# EAGLE design M506C (EAGLE 6.6.0)
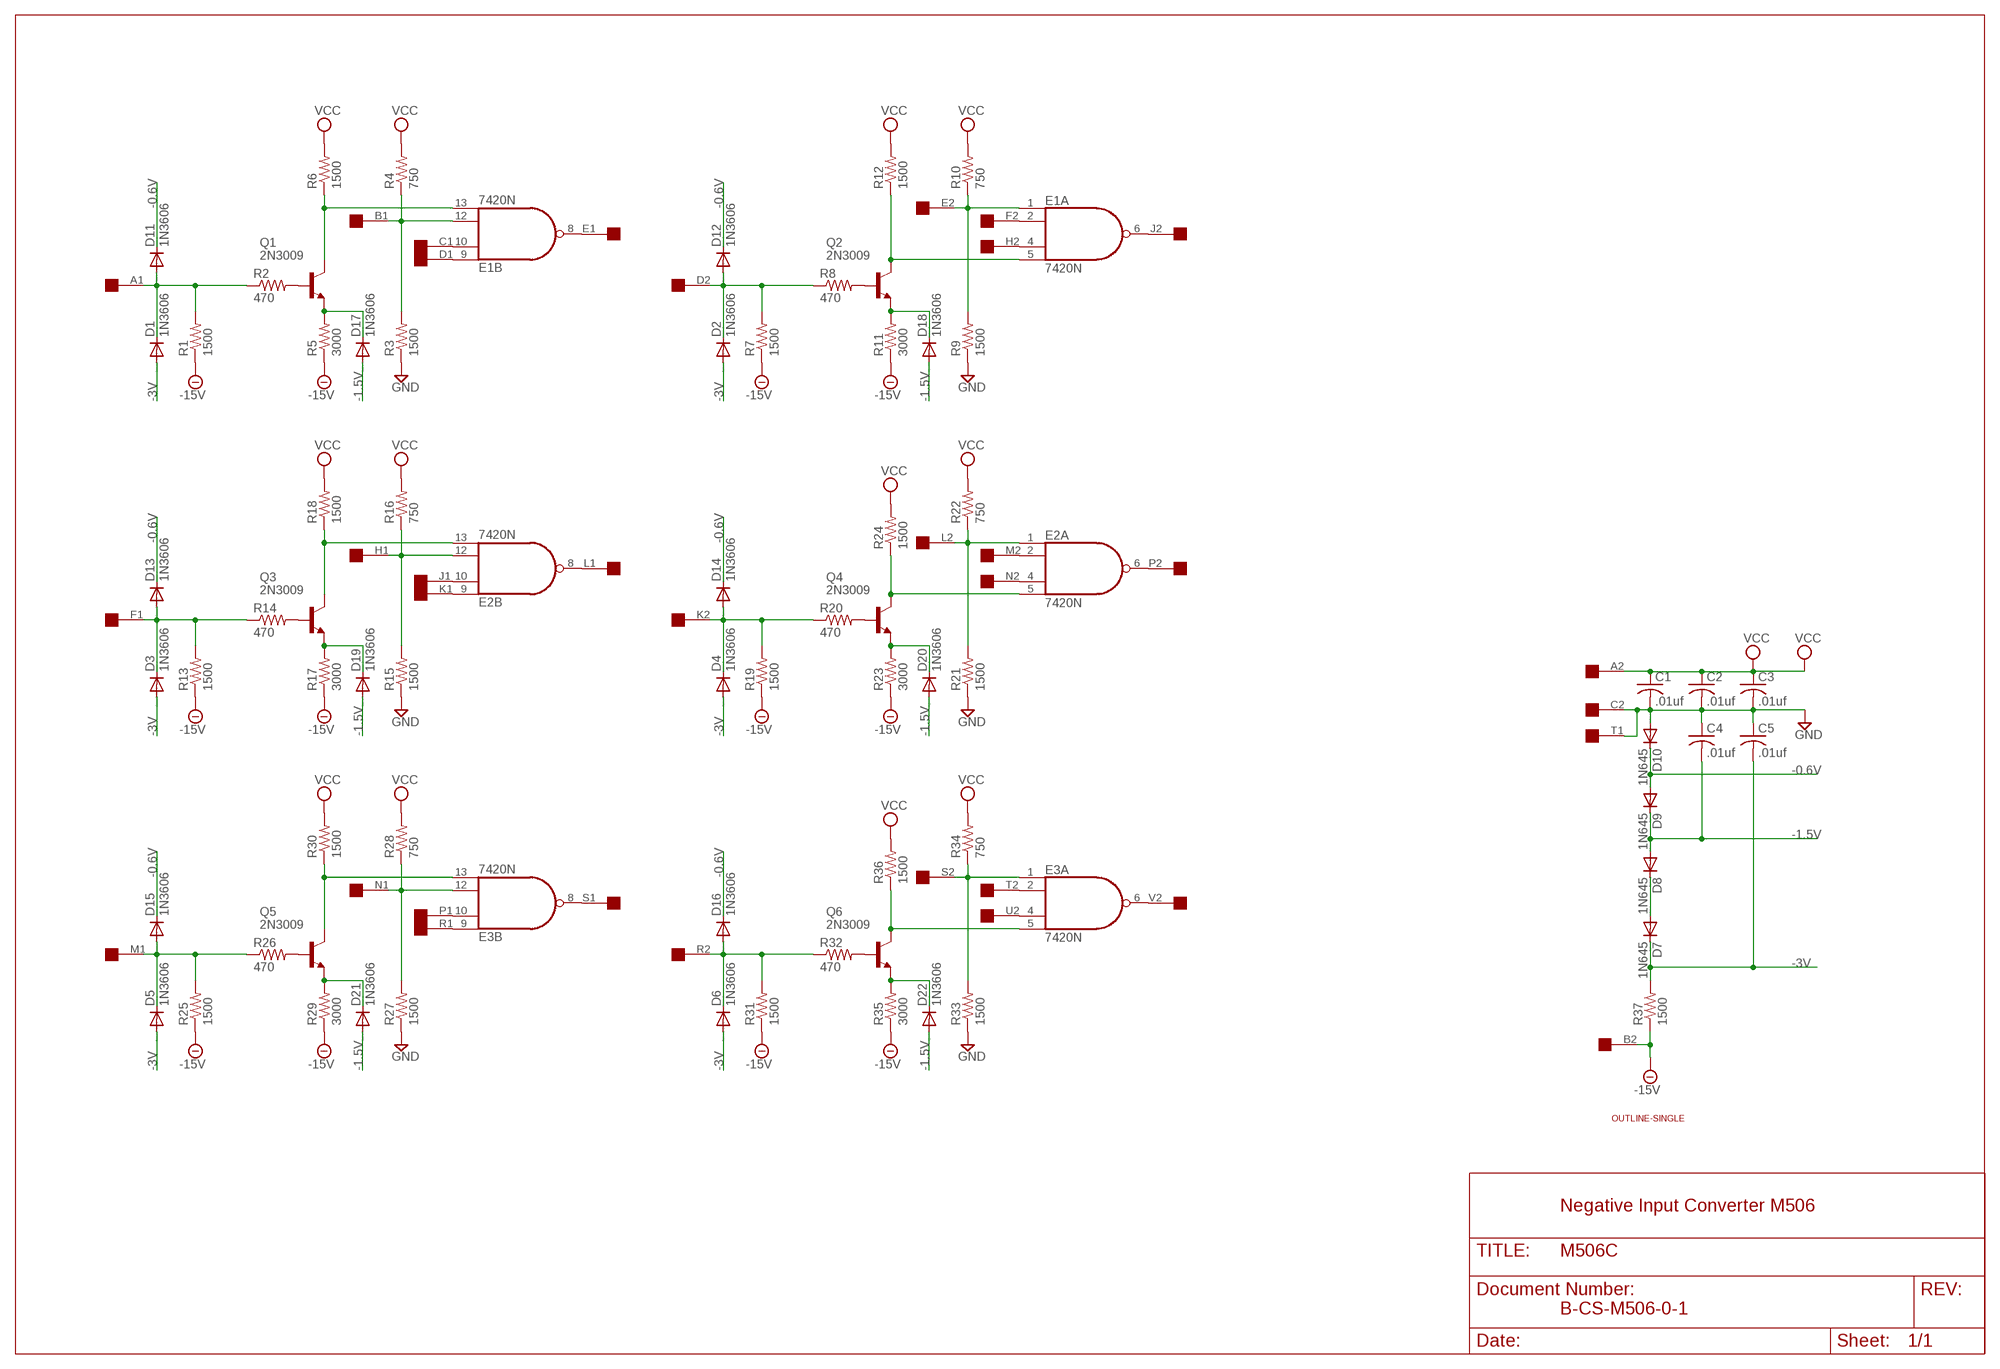
[diagram p0: schematic, sheet 1]

## Parts
C1  .01uf  C-US050-025X075  [C050-025X075]
C2  .01uf  C-US050-025X075  [C050-025X075]
C3  .01uf  C-US050-025X075  [C050-025X075]
C4  .01uf  C-US050-025X075  [C050-025X075]
C5  .01uf  C-US050-025X075  [C050-025X075]
D1  1N3606  1N4148DO35-10  [DO35-10]
D2  1N3606  1N4148DO35-10  [DO35-10]
D3  1N3606  1N4148DO35-10  [DO35-10]
D4  1N3606  1N4148DO35-10  [DO35-10]
D5  1N3606  1N4148DO35-10  [DO35-10]
D6  1N3606  1N4148DO35-10  [DO35-10]
D7  1N645  1N4148DO35-10  [DO35-10]
D8  1N645  1N4148DO35-10  [DO35-10]
D9  1N645  1N4148DO35-10  [DO35-10]
D10  1N645  1N4148DO35-10  [DO35-10]
D11  1N3606  1N4148DO35-10  [DO35-10]
D12  1N3606  1N4148DO35-10  [DO35-10]
D13  1N3606  1N4148DO35-10  [DO35-10]
D14  1N3606  1N4148DO35-10  [DO35-10]
D15  1N3606  1N4148DO35-10  [DO35-10]
D16  1N3606  1N4148DO35-10  [DO35-10]
D17  1N3606  1N4148DO35-10  [DO35-10]
D18  1N3606  1N4148DO35-10  [DO35-10]
D19  1N3606  1N4148DO35-10  [DO35-10]
D20  1N3606  1N4148DO35-10  [DO35-10]
D21  1N3606  1N4148DO35-10  [DO35-10]
D22  1N3606  1N4148DO35-10  [DO35-10]
E1  7420N  74S20N  [DIL14]
E2  7420N  74S20N  [DIL14]
E3  7420N  74S20N  [DIL14]
Q1  2N3009  2N3019  [TO39]
Q2  2N3009  2N3019  [TO39]
Q3  2N3009  2N3019  [TO39]
Q4  2N3009  2N3019  [TO39]
Q5  2N3009  2N3019  [TO39]
Q6  2N3009  2N3019  [TO39]
R1  1500  R-US_0207/10  [0207/10]
R2  470  R-US_0207/10  [0207/10]
R3  1500  R-US_0207/10  [0207/10]
R4  750  R-US_0207/10  [0207/10]
R5  3000  R-US_0207/10  [0207/10]
R6  1500  R-US_0207/10  [0207/10]
R7  1500  R-US_0207/10  [0207/10]
R8  470  R-US_0207/10  [0207/10]
R9  1500  R-US_0207/10  [0207/10]
R10  750  R-US_0207/10  [0207/10]
R11  3000  R-US_0207/10  [0207/10]
R12  1500  R-US_0207/10  [0207/10]
R13  1500  R-US_0207/10  [0207/10]
R14  470  R-US_0207/10  [0207/10]
R15  1500  R-US_0207/10  [0207/10]
R16  750  R-US_0207/10  [0207/10]
R17  3000  R-US_0207/10  [0207/10]
R18  1500  R-US_0207/10  [0207/10]
R19  1500  R-US_0207/10  [0207/10]
R20  470  R-US_0207/10  [0207/10]
R21  1500  R-US_0207/10  [0207/10]
R22  750  R-US_0207/10  [0207/10]
R23  3000  R-US_0207/10  [0207/10]
R24  1500  R-US_0207/10  [0207/10]
R25  1500  R-US_0207/10  [0207/10]
R26  470  R-US_0207/10  [0207/10]
R27  1500  R-US_0207/10  [0207/10]
R28  750  R-US_0207/10  [0207/10]
R29  3000  R-US_0207/10  [0207/10]
R30  1500  R-US_0207/10  [0207/10]
R31  1500  R-US_0207/10  [0207/10]
R32  470  R-US_0207/10  [0207/10]
R33  1500  R-US_0207/10  [0207/10]
R34  750  R-US_0207/10  [0207/10]
R35  3000  R-US_0207/10  [0207/10]
R36  1500  R-US_0207/10  [0207/10]
R37  1500  R-US_0207/10  [0207/10]
U$2  SINGLE  [EDGE-CON2]
U$4  OUTLINE-SINGLE  [SINGLE]

## Nets
-0.6V [Supply]: D9.A D10.C D11.C D12.C D13.C D14.C D15.C D16.C
-1.5V [Supply]: C4.2 D8.A D9.C D17.A D18.A D19.A D20.A D21.A D22.A
-3V: C5.2 D1.A D2.A D3.A D4.A D5.A D6.A D7.C R37.2
-15V [Supply]: R1.1 R5.1 R7.1 R11.1 R13.1 R17.1 R19.1 R23.1 R25.1 R29.1 R31.1 R35.1 R37.1 U$2.B2
GND [Supply]: C1.2 C2.2 C3.2 C4.1 C5.1 D10.A R3.1 R9.1 R15.1 R21.1 R27.1 R33.1 U$2.C2 U$2.T1
N$1: D1.C D11.A R1.2 R2.1 U$2.A1
N$2: Q1.2(B) R2.2
N$3: D17.C Q1.1(E) R5.2
N$4: E1.12(B:I2) R3.2 R4.1 U$2.B1
N$5: E1.13(B:I3) Q1.3(C) R6.1
N$6: E1.10(B:I1) U$2.C1
N$7: E1.9(B:I0) U$2.D1
N$8: E1.8(B:O) U$2.E1
N$9: D2.C D12.A R7.2 R8.1 U$2.D2
N$10: Q2.2(B) R8.2
N$11: D18.C Q2.1(E) R11.2
N$12: E1.1(A:I0) R9.2 R10.1 U$2.E2
N$14: E1.5(A:I3) Q2.3(C) R12.1
N$15: E1.6(A:O) U$2.J2
N$16: E1.2(A:I1) U$2.F2
N$17: E1.4(A:I2) U$2.H2
N$18: D3.C D13.A R13.2 R14.1 U$2.F1
N$19: Q3.2(B) R14.2
N$20: D19.C Q3.1(E) R17.2
N$21: E2.12(B:I2) R15.2 R16.1 U$2.H1
N$22: E2.13(B:I3) Q3.3(C) R18.1
N$23: D5.C D15.A R25.2 R26.1 U$2.M1
N$24: Q5.2(B) R26.2
N$25: D21.C Q5.1(E) R29.2
N$26: D4.C D14.A R19.2 R20.1 U$2.K2
N$27: Q4.2(B) R20.2
N$28: D20.C Q4.1(E) R23.2
N$29: E2.1(A:I0) R21.2 R22.1 U$2.L2
N$30: E2.5(A:I3) Q4.3(C) R24.1
N$31: E3.12(B:I2) R27.2 R28.1 U$2.N1
N$32: E3.13(B:I3) Q5.3(C) R30.1
N$33: D6.C D16.A R31.2 R32.1 U$2.R2
N$34: Q6.2(B) R32.2
N$35: D22.C Q6.1(E) R35.2
N$36: E3.1(A:I0) R33.2 R34.1 U$2.S2
N$37: E3.5(A:I3) Q6.3(C) R36.1
N$38: E2.10(B:I1) U$2.J1
N$39: E2.9(B:I0) U$2.K1
N$40: E3.10(B:I1) U$2.P1
N$41: E3.9(B:I0) U$2.R1
N$42: E2.8(B:O) U$2.L1
N$43: E3.8(B:O) U$2.S1
N$44: E2.2(A:I1) U$2.M2
N$45: E2.4(A:I2) U$2.N2
N$46: E2.6(A:O) U$2.P2
N$47: E3.4(A:I2) U$2.U2
N$48: E3.6(A:O) U$2.V2
N$49: E3.2(A:I1) U$2.T2
N$51: D7.A D8.C
VCC [Supply]: C1.1 C2.1 C3.1 R4.2 R6.2 R10.2 R12.2 R16.2 R18.2 R22.2 R24.2 R28.2 R30.2 R34.2 R36.2 U$2.A2
Unconnected: U$2.U1 U$2.V1

## Notes on the sheet
- Negative Input Converter M506
- B-CS-M506-0-1

## Power pins joined to a net without a drawn wire
GND: E1.7(P:GND) E2.7(P:GND) E3.7(P:GND)
VCC: E1.14(P:VCC) E2.14(P:VCC) E3.14(P:VCC)

## Library data of the parts
C1-C5 = rcl:C-US: CAPACITOR, American symbol
D1-D22 = diode:1N4148: DIODE high speed (Philips)
E1-E3 = 74xx-us:74*20: Dual 4-input NAND gate
Q1-Q6 = transistor-npn:2N3019: NPN Transistor
R1-R37 = rcl:R-US_: RESISTOR, American symbol
U$2 = dec-con:SINGLE: Single-Height DEC board
U$4 = dec-con:OUTLINE-*: Board outlines for DEC boards.

## Net classes
1 Supply: width 0.813 mm

## Board
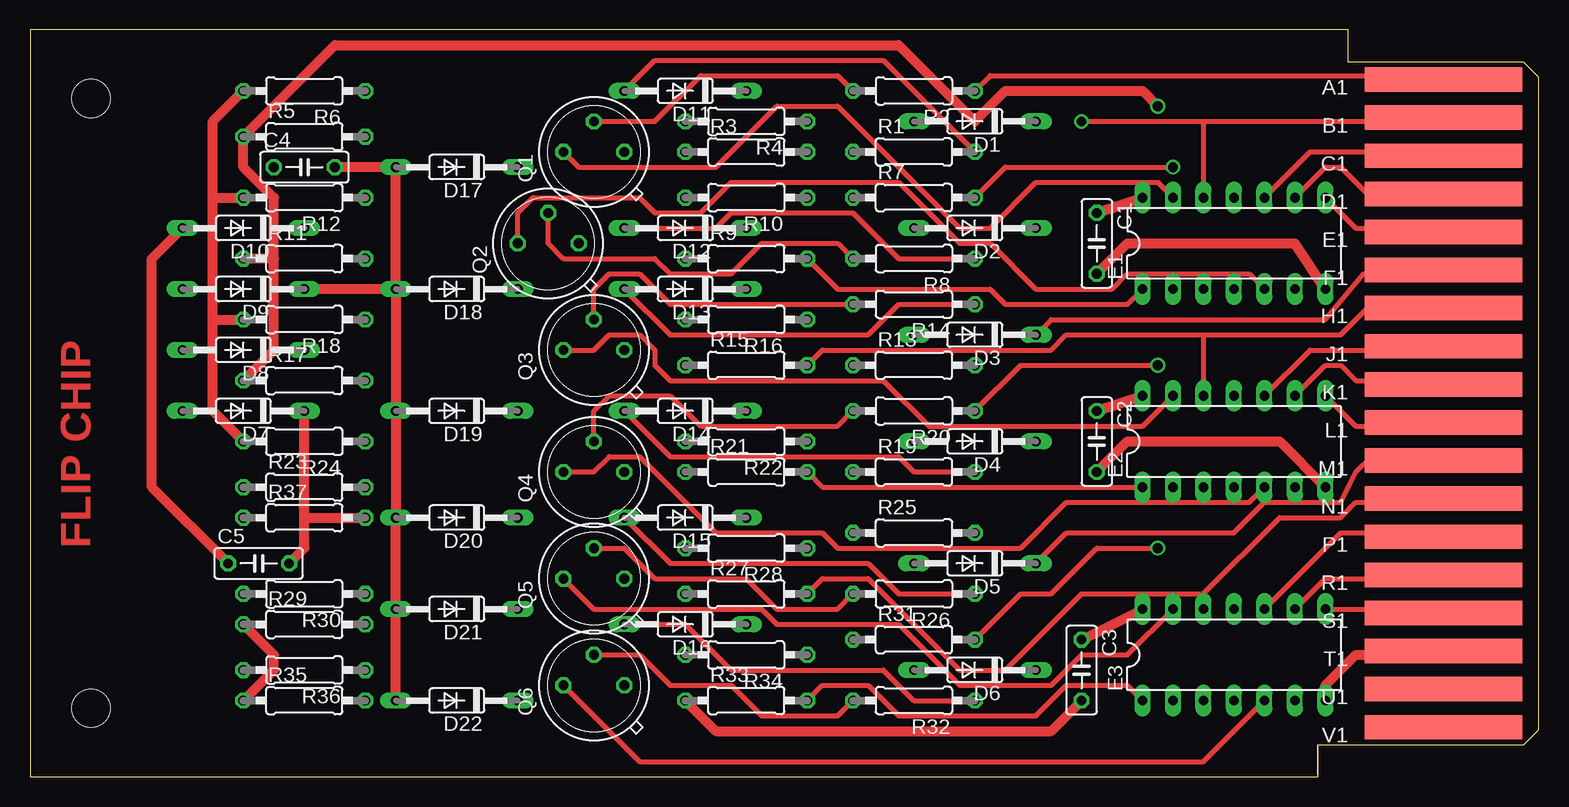
[diagram p1: board, top side]
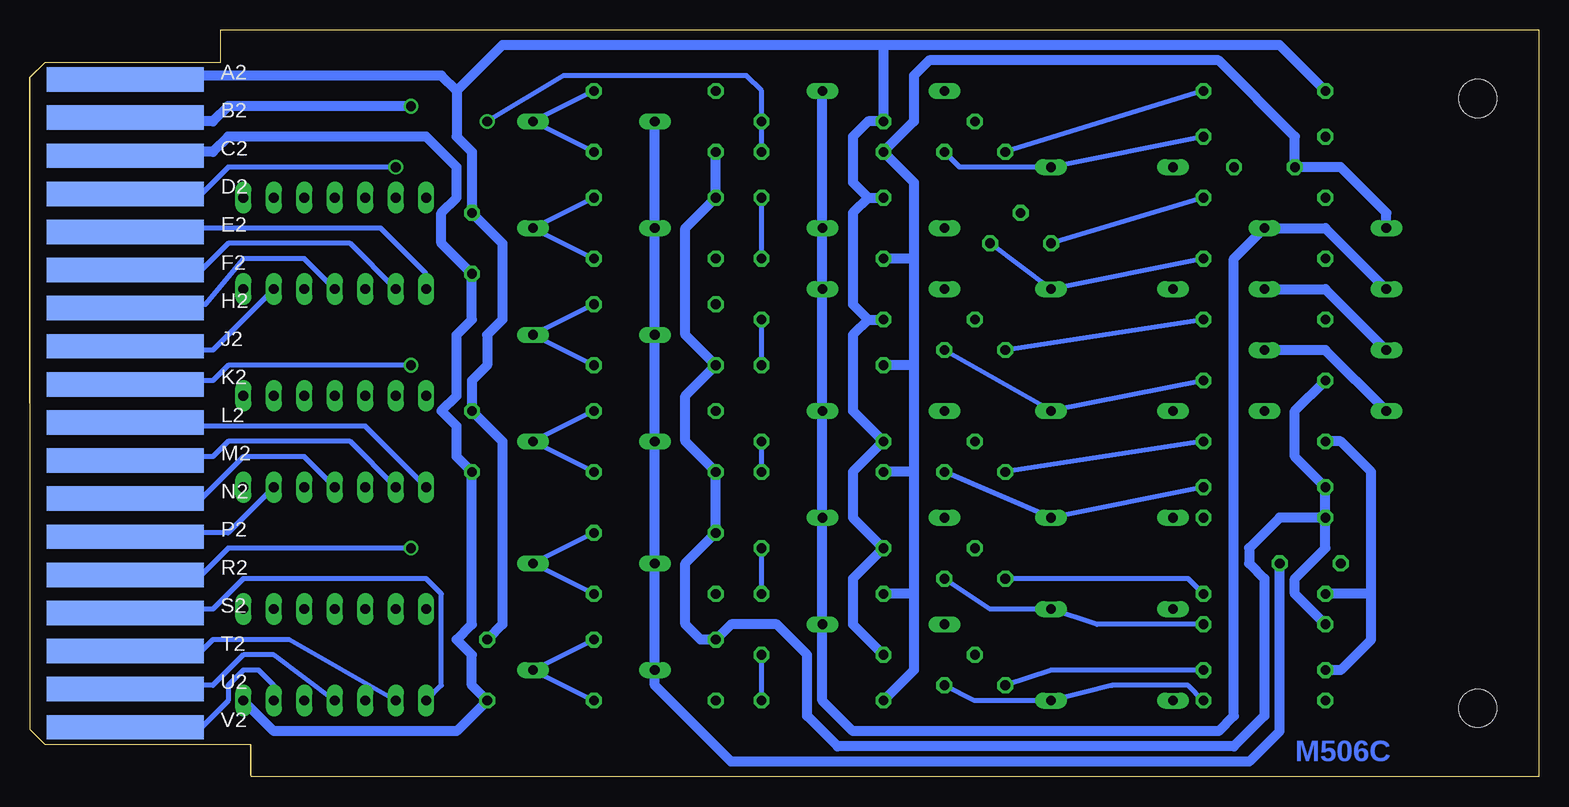
[diagram p2: board, bottom side, seen from below]

Size 125.73 x 62.23 mm. Coordinates in mm from the lower left corner, seen from the top.
Copper layers (1+16): Top 0.035mm / dielectric 1.5mm / Bottom 0.035mm
Design rules "16mils": minimum track width 16mil, minimum drill 32mil, track to track 15mil, track to pad 10mil, pad to pad 10mil, via to via 10mil, smd to smd 10mil, copper to edge 13mil, drill to drill 10mil, minimum pad ring 10mil, minimum via ring 8mil, stop-mask expansion 0mil, vias tented up to drill 0mil, thermal gap 10mil

### Footprints (pad centres in the part's own frame; a part is rotated, then mirrored left to right if it is on the bottom)
C050-025X075 = drill 0.813 octagon: 1 -2.54,0; 2 2.54,0
DO35-10 = drill 0.813 long: A 5.08,0; C -5.08,0
DIL14 = drill 0.813 long: 1 -7.62,-3.81; 2 -5.08,-3.81; 3 -2.54,-3.81; 4 0,-3.81; 5 2.54,-3.81; 6 5.08,-3.81; 7 7.62,-3.81; 8 7.62,3.81; 9 5.08,3.81; 10 2.54,3.81; 11 0,3.81; 12 -2.54,3.81; 13 -5.08,3.81; 14 -7.62,3.81
TO39 = drill 0.813 octagon: 1 0,-2.54; 2 2.54,0; 3 0,2.54
0207/10 = drill 0.813 octagon: 1 -5.08,0; 2 5.08,0
EDGE-CON2 = smd 13.106 x 2.032: A1 7.938,4.128; B1 7.938,7.303; C1 7.938,10.477; D1 7.938,13.652; E1 7.938,16.828; F1 7.938,20.003; H1 7.938,23.177; J1 7.938,26.352; K1 7.938,29.527; L1 7.938,32.703; M1 7.938,35.877; N1 7.938,39.053; P1 7.938,42.227; R1 7.938,45.403; S1 7.938,48.578; T1 7.938,51.752; U1 7.938,54.928; V1 7.938,58.102 | smd 13.106 x 2.032 bottom: A2 7.938,4.128; B2 7.938,7.303; C2 7.938,10.477; D2 7.938,13.652; E2 7.938,16.828; F2 7.938,20.003; H2 7.938,23.177; J2 7.938,26.352; K2 7.938,29.527; L2 7.938,32.703; M2 7.938,35.877; N2 7.938,39.053; P2 7.938,42.227; R2 7.938,45.403; S2 7.938,48.578; T2 7.938,51.752; U2 7.938,54.928; V2 7.938,58.102
SINGLE = hole 3.175: 120.65,56.515; 120.65,5.715

### Placement (x,y rotation side)
C1  88.9,44.45 270 top
C2  88.9,27.94 270 top
C3  87.63,8.89 270 top
C4  22.86,50.8 0 top
C5  19.05,17.78 0 top
D1  78.74,54.61 180 top
D2  78.74,45.72 180 top
D3  78.74,36.83 180 top
D4  78.74,27.94 180 top
D5  78.74,17.78 180 top
D6  78.74,8.89 180 top
D7  17.78,30.48 180 top
D8  17.78,35.56 180 top
D9  17.78,40.64 180 top
D10  17.78,45.72 180 top
D11  54.61,57.15 180 top
D12  54.61,45.72 180 top
D13  54.61,40.64 180 top
D14  54.61,30.48 180 top
D15  54.61,21.59 180 top
D16  54.61,12.7 180 top
D17  35.56,50.8 180 top
D18  35.56,40.64 180 top
D19  35.56,30.48 180 top
D20  35.56,21.59 180 top
D21  35.56,13.97 180 top
D22  35.56,6.35 180 top
E1  100.33,44.45 0 top
E2  100.33,27.94 0 top
E3  100.33,10.16 0 top
Q1  46.99,52.07 90 top
Q2  43.18,44.45 90 top
Q3  46.99,35.56 90 top
Q4  46.99,25.4 90 top
Q5  46.99,16.51 90 top
Q6  46.99,7.62 90 top
R1  73.66,52.07 0 top
R2  73.66,57.15 180 top
R3  59.69,52.07 0 top
R4  59.69,54.61 180 top
R5  22.86,53.34 0 top
R6  22.86,57.15 180 top
R7  73.66,48.26 0 top
R8  73.66,43.18 180 top
R9  59.69,43.18 0 top
R10  59.69,48.26 180 top
R11  22.86,43.18 0 top
R12  22.86,48.26 180 top
R13  73.66,34.29 0 top
R14  73.66,39.37 180 top
R15  59.69,34.29 0 top
R16  59.69,38.1 180 top
R17  22.86,33.02 0 top
R18  22.86,38.1 180 top
R19  73.66,25.4 0 top
R20  73.66,30.48 180 top
R21  59.69,25.4 0 top
R22  59.69,27.94 180 top
R23  22.86,24.13 0 top
R24  22.86,27.94 180 top
R25  73.66,20.32 0 top
R26  73.66,15.24 180 top
R27  59.69,15.24 0 top
R28  59.69,19.05 180 top
R29  22.86,12.7 0 top
R30  22.86,15.24 180 top
R31  73.66,11.43 0 top
R32  73.66,6.35 180 top
R33  59.69,6.35 0 top
R34  59.69,10.16 180 top
R35  22.86,6.35 0 top
R36  22.86,8.89 180 top
R37  22.86,21.59 0 top
U$1  [FLIPCHIP]  0,0 0 top
U$2  125.73,62.23 180 top
U$4  125.73,62.23 180 top

### Tracks (layer width: path | path; a pad name or v marks a point on that pad's centre or on a via)
-0.6V
  Bottom 0.813: D9.A 17.78,45.72 D10.C 25.4,43.18 25.4,5.08 26.67,3.81 57.15,3.81 59.69,6.35 D16.C D15.C D14.C D13.C D12.C D11.C
-1.5V
  Top 0.813: C4.2 D17.A D18.A | D18.A D9.C | D22.A D21.A D20.A D19.A D18.A
  Bottom 0.813: D8.A 17.78,40.64 D9.C
-3V
  Top 0.813: C5.2 22.86,19.05 22.86,21.59 | 22.86,21.59 D7.C | 22.86,21.59 R37.2
  Bottom 0.813: D1.A D2.A D3.A D4.A D5.A D6.A 73.66,7.62 67.31,1.27 24.13,1.27 21.59,3.81 C5.2
-15V  (via drill 0.81)
  Top 0.813: R35.1 20.32,8.89 20.32,10.16 R29.1 | R17.1 20.32,35.56 20.32,43.18 | 20.32,43.18 R11.1 | 20.32,43.18 20.32,48.26 17.78,50.8 R5.1 25.4,60.96 72.39,60.96 78.74,54.61 81.28,57.15 92.71,57.15 v93.98,55.88
  Bottom 0.813: R29.1 20.32,15.24 20.32,16.51 17.78,19.05 R37.1 | R37.1 R23.1 20.32,26.67 20.32,30.48 R17.1 | R1.1 R7.1 71.12,45.72 71.12,36.83 R13.1 71.12,31.75 71.12,27.94 R19.1 R25.1 71.12,17.78 71.12,12.7 69.85,11.43 R31.1 67.31,12.7 63.5,12.7 60.96,10.16 60.96,5.08 58.42,2.54 25.4,2.54 22.86,5.08 22.86,16.51 24.13,17.78 24.13,19.05 21.59,21.59 R37.1 | U$2.B2 117.8,54.61 110.49,54.61 109.22,55.88 v93.98,55.88
GND
  Top 0.813: C5.1 10.16,24.13 10.16,43.18 D10.A | U$2.T1 117.76,10.16 111.76,10.16 110.49,10.16 107.95,7.62 E3.7 | C3.2 85.09,3.81 57.15,3.81 R33.1 | E1.7 105.41,44.45 91.44,44.45 C1.2 | E2.7 104.14,27.94 91.44,27.94 C2.2
  Bottom 0.813: R33.1 52.07,8.89 52.07,15.24 | 52.07,15.24 R27.1 | 52.07,25.4 R21.1 | 52.07,25.4 52.07,15.24 | 52.07,34.29 R15.1 | 52.07,34.29 52.07,25.4 | 52.07,43.18 52.07,34.29 | 52.07,43.18 52.07,49.53 R3.1 52.07,54.61 52.07,58.42 50.8,59.69 26.67,59.69 20.32,53.34 C4.1 16.51,50.8 12.7,46.99 D10.A | 52.07,43.18 R9.1 | U$2.C2 117.78,52.07 110.49,52.07 109.22,53.34 92.71,53.34 90.17,50.8 90.17,48.26 91.44,46.99 91.44,44.45 C1.2 88.9,38.1 90.17,36.83 90.17,31.75 91.44,30.48 90.17,29.21 90.17,26.67 C2.2 88.9,12.7 90.17,11.43 88.9,10.16 88.9,7.62 C3.2 90.17,3.81 105.41,3.81 E3.7
N$1
  Top 0.406: U$2.A1 117.24,58.02 116.84,58.42 80.01,58.42 R2.1 | D11.A 52.07,59.69 71.12,59.69 R1.2
  Bottom 0.406: R1.2 D1.C R2.1
N$2
  Top 0.406: Q1.2 52.07,54.61 55.88,58.42 67.31,58.42 R2.2
N$3
  Bottom 0.406: R5.2 D17.C 48.26,50.8 Q1.1
N$4  (via drill 0.81)
  Top 0.406: U$2.B1 117.8,54.61 97.79,54.61 | v87.63,54.61 97.79,54.61 | 97.79,54.61 E1.12
  Bottom 0.406: R3.2 R4.1 64.77,57.15 66.04,58.42 81.28,58.42 v87.63,54.61
N$5
  Top 0.406: E1.13 93.98,49.53 83.82,49.53 80.01,45.72 77.47,45.72 67.31,55.88 62.23,55.88 57.15,50.8 45.72,50.8 Q1.3
  Bottom 0.406: R6.1 Q1.3
N$6
  Top 0.406: U$2.C1 117.17,51.74 116.84,52.07 106.68,52.07 E1.10
N$7
  Top 0.406: U$2.D1 115.88,48.56 115.57,48.26 111.76,48.26 109.22,50.8 107.95,50.8 E1.9
N$8
  Top 0.406: U$2.E1 117.17,45.39 116.84,45.72 110.49,45.72 E1.8
N$9  (via drill 0.81)
  Top 0.406: v95.25,50.8 81.28,50.8 R7.2 | D12.A 57.15,45.72 58.42,46.99 68.58,46.99 72.39,43.18 R8.1
  Bottom 0.406: R8.1 D2.C R7.2 | U$2.D2 117.78,48.26 111.76,48.26 109.22,50.8 v95.25,50.8
N$10
  Top 0.406: Q2.2 43.18,44.45 44.45,43.18 52.07,43.18 53.34,41.91 58.42,41.91 60.96,44.45 67.31,44.45 R8.2
N$11
  Bottom 0.406: R11.2 D18.C Q2.1
N$12
  Top 0.406: E1.1 91.44,39.37 81.28,39.37 80.01,40.64 67.31,40.64 R9.2
  Bottom 0.406: R9.2 R10.1 | U$2.E2 117.17,45.39 116.84,45.72 96.52,45.72 92.71,41.91 E1.1
N$14
  Top 0.406: E1.5 101.6,41.91 91.44,41.91 90.17,40.64 83.82,40.64 80.01,44.45 77.47,44.45 72.39,49.53 58.42,49.53 55.88,46.99 52.07,46.99 50.8,48.26 41.91,48.26 40.64,46.99 Q2.3
  Bottom 0.406: R12.1 Q2.3
N$15
  Bottom 0.406: U$2.J2 117.17,35.89 116.84,35.56 110.49,35.56 E1.6
N$16
  Bottom 0.406: U$2.F2 117.12,42.19 116.84,41.91 111.76,41.91 109.22,44.45 99.06,44.45 E1.2
N$17
  Bottom 0.406: U$2.H2 117.17,39.04 116.84,39.37 111.12,39.37 107.95,43.18 102.87,43.18 E1.4
N$18
  Top 0.406: D3.C 85.09,38.1 107.95,38.1 111.12,41.91 117.81,41.91 U$2.F1 | D13.A 53.34,36.83 69.85,36.83 72.39,39.37 R14.1
  Bottom 0.406: R13.2 D3.C R14.1
N$19
  Top 0.406: Q3.2 46.99,40.64 48.26,41.91 50.8,41.91 53.34,39.37 R14.2
N$20
  Bottom 0.406: R17.2 D19.C Q3.1
N$21
  Top 0.406: U$2.H1 117.76,39.37 111.76,39.37 109.22,36.83 97.79,36.83 | 97.79,36.83 E2.12 | 97.79,36.83 86.36,36.83 85.09,35.56 66.04,35.56 R15.2
  Bottom 0.406: R15.2 R16.1
N$22
  Top 0.406: E2.13 92.71,29.21 74.93,29.21 71.12,33.02 53.34,33.02 52.07,34.29 52.07,35.56 50.8,36.83 48.26,36.83 46.99,35.56 Q3.3
  Bottom 0.406: R18.1 Q3.3
N$23
  Top 0.406: U$2.M1 117.17,26.34 116.84,26.67 111.76,26.67 110.49,25.4 109.22,22.86 102.87,22.86 100.33,20.32 86.36,20.32 D5.C | D15.A 53.34,17.78 69.85,17.78 72.39,15.24 R26.1
  Bottom 0.406: R26.1 D5.C R25.2
N$24
  Top 0.406: Q5.2 49.53,19.05 52.07,16.51 59.69,16.51 62.23,13.97 67.31,13.97 R26.2
N$25
  Bottom 0.406: R29.2 36.83,12.7 D21.C 45.72,13.97 Q5.1
N$26  (via drill 0.81)
  Top 0.406: v93.98,34.29 82.55,34.29 R20.1 | D14.A 53.34,26.67 72.39,26.67 73.66,25.4 R19.2
  Bottom 0.406: R19.2 D4.C R20.1 | U$2.K2 117.78,33.02 110.49,33.02 109.22,34.29 v93.98,34.29
N$27
  Top 0.406: Q4.2 46.99,30.48 48.26,31.75 53.34,31.75 55.88,29.21 67.31,29.21 R20.2
N$28
  Bottom 0.406: Q4.1 D20.C R23.2
N$29
  Top 0.406: E2.1 66.04,24.13 R21.2
  Bottom 0.406: R21.2 R22.1 | U$2.L2 117.17,29.54 116.84,29.21 97.79,29.21 E2.1
N$30
  Top 0.406: E2.5 101.6,22.86 86.36,22.86 82.55,19.05 67.31,19.05 66.04,20.32 57.15,20.32 50.8,26.67 48.26,26.67 46.99,25.4 Q4.3
  Bottom 0.406: R24.1 Q4.3
N$31
  Top 0.406: U$2.N1 117.17,23.19 116.84,22.86 110.49,22.86 109.22,21.59 104.14,21.59 97.79,15.24 | 97.79,15.24 E3.12 | 97.79,15.24 87.63,15.24 81.28,8.89 77.47,8.89 69.85,16.51 66.04,16.51 R27.2
  Bottom 0.406: R27.2 R28.1
N$32
  Top 0.406: E3.13 91.44,10.16 87.63,10.16 85.09,7.62 77.47,7.62 72.39,12.7 62.23,12.7 60.96,13.97 46.99,13.97 Q5.3
  Bottom 0.406: R30.1 29.21,16.51 Q5.3
N$33  (via drill 0.81)
  Top 0.406: v93.98,19.05 88.9,19.05 85.09,15.24 82.55,15.24 R31.2 | D16.A 54.61,12.7 58.42,8.89 71.12,8.89 73.66,6.35 R32.1
  Bottom 0.406: R32.1 D6.C R31.2 | U$2.R2 117.17,16.84 116.84,16.51 111.76,16.51 109.22,19.05 v93.98,19.05
N$34
  Top 0.406: R32.2 67.31,5.08 60.96,5.08 58.42,7.62 53.34,7.62 50.8,10.16 Q6.2
N$35
  Bottom 0.406: R35.2 29.21,7.62 35.56,7.62 D22.C 46.99,6.35 Q6.1
N$36
  Top 0.406: E3.1 91.44,7.62 86.36,7.62 83.82,5.08 72.39,5.08 69.85,7.62 66.04,7.62 R33.2
  Bottom 0.406: U$2.S2 117.78,13.97 110.49,13.97 107.95,16.51 92.71,16.51 91.44,15.24 91.44,7.62 E3.1 | R33.2 R34.1
N$37
  Top 0.406: E3.5 97.79,1.27 50.8,1.27 Q6.3
  Bottom 0.406: R36.1 40.64,8.89 Q6.3
N$38
  Top 0.406: U$2.J1 117.76,35.56 106.68,35.56 E2.10
N$39
  Top 0.406: U$2.K1 117.78,33.02 110.49,33.02 109.22,34.29 107.95,34.29 E2.9
N$40
  Top 0.406: U$2.P1 117.17,19.99 116.84,20.32 109.22,20.32 E3.10
N$41
  Top 0.406: U$2.R1 117.17,16.84 116.84,16.51 107.95,16.51 E3.9
N$42
  Top 0.406: U$2.L1 117.76,29.21 110.49,29.21 E2.8
N$43
  Top 0.406: U$2.S1 117.78,13.97 E3.8
N$44
  Bottom 0.406: U$2.M2 117.17,26.34 116.84,26.67 110.49,26.67 109.22,27.94 99.06,27.94 E2.2
N$45
  Bottom 0.406: U$2.N2 117.17,23.19 116.84,22.86 111.76,22.86 107.95,26.67 102.87,26.67 E2.4
N$46
  Bottom 0.406: U$2.P2 117.17,19.99 116.84,20.32 109.22,20.32 E2.6
N$47
  Bottom 0.406: U$2.U2 117.73,7.62 110.49,7.62 107.95,10.16 105.41,10.16 E3.4
N$48
  Bottom 0.406: U$2.V2 117.69,3.81 111.76,3.81 109.22,6.35 109.22,7.62 107.95,8.89 106.68,8.89 105.41,7.62 E3.6
N$49
  Bottom 0.406: U$2.T2 117.76,10.16 111.76,10.16 110.49,11.43 104.14,11.43 E3.2
N$51
  Bottom 0.813: D7.A 17.78,35.56 D8.C
VCC
  Top 0.813: R6.2 15.24,54.61 15.24,48.26 | 15.24,48.26 R12.2 | 15.24,38.1 R18.2 | 15.24,38.1 15.24,48.26 | R24.2 15.24,30.48 15.24,38.1 | C1.1 E1.14 | C2.1 E2.14 | C3.1 E3.14
  Bottom 0.813: U$2.A2 116.84,58.02 116.84,58.42 91.44,58.42 90.17,57.15 | 90.17,57.15 90.17,53.34 88.9,52.07 C1.1 86.36,44.45 86.36,38.1 87.63,36.83 87.63,34.29 88.9,33.02 C2.1 86.36,27.94 86.36,12.7 C3.1 | 90.17,57.15 86.36,60.96 54.61,60.96 | 54.61,60.96 R4.2 55.88,54.61 57.15,53.34 57.15,49.53 55.88,48.26 | 55.88,48.26 R10.2 | 55.88,38.1 R16.2 | 55.88,38.1 57.15,39.37 57.15,46.99 55.88,48.26 | 55.88,38.1 57.15,36.83 57.15,30.48 R22.2 57.15,25.4 57.15,21.59 R28.2 57.15,16.51 57.15,12.7 R34.2 | R6.2 21.59,60.96 54.61,60.96 | R36.2 16.51,8.89 13.97,11.43 13.97,15.24 | 13.97,15.24 13.97,25.4 16.51,27.94 R24.2 | 13.97,15.24 R30.2

### Text on the board
Bottom: M506C